# EAGLE design heart_ckt (EAGLE 8.4.1)
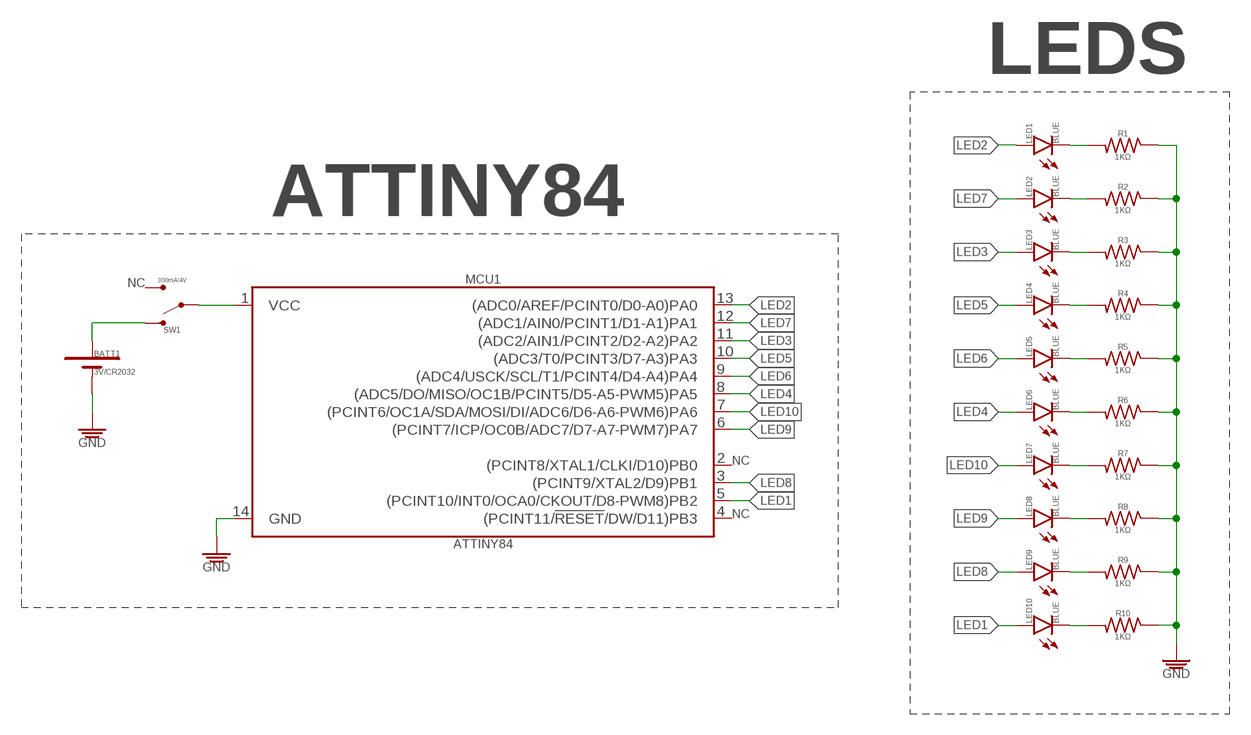
[diagram p0: schematic, sheet 1]

## Parts
BATT1  3V/CR2032  BATTERY_CELL_COINCELL-CR2032-20MM_PTH  [BATTERY_COINCELL-20MM-PTH]
LED1  BLUE  LED_SMD-0805_DISCRETE_BLUE  [LED_SMD-805_]
LED2  BLUE  LED_SMD-0805_DISCRETE_BLUE  [LED_SMD-805_]
LED3  BLUE  LED_SMD-0805_DISCRETE_BLUE  [LED_SMD-805_]
LED4  BLUE  LED_SMD-0805_DISCRETE_BLUE  [LED_SMD-805_]
LED5  BLUE  LED_SMD-0805_DISCRETE_BLUE  [LED_SMD-805_]
LED6  BLUE  LED_SMD-0805_DISCRETE_BLUE  [LED_SMD-805_]
LED7  BLUE  LED_SMD-0805_DISCRETE_BLUE  [LED_SMD-805_]
LED8  BLUE  LED_SMD-0805_DISCRETE_BLUE  [LED_SMD-805_]
LED9  BLUE  LED_SMD-0805_DISCRETE_BLUE  [LED_SMD-805_]
LED10  BLUE  LED_SMD-0805_DISCRETE_BLUE  [LED_SMD-805_]
MCU1  ATTINY84  ATTINY84_SO-14  [SO-14]
R1  1KΩ  1KΩ_SMD-0805_1/8W-5%  [RESISTOR_SMD-805]
R2  1KΩ  1KΩ_SMD-0805_1/8W-5%  [RESISTOR_SMD-805]
R3  1KΩ  1KΩ_SMD-0805_1/8W-5%  [RESISTOR_SMD-805]
R4  1KΩ  1KΩ_SMD-0805_1/8W-5%  [RESISTOR_SMD-805]
R5  1KΩ  1KΩ_SMD-0805_1/8W-5%  [RESISTOR_SMD-805]
R6  1KΩ  1KΩ_SMD-0805_1/8W-5%  [RESISTOR_SMD-805]
R7  1KΩ  1KΩ_SMD-0805_1/8W-5%  [RESISTOR_SMD-805]
R8  1KΩ  1KΩ_SMD-0805_1/8W-5%  [RESISTOR_SMD-805]
R9  1KΩ  1KΩ_SMD-0805_1/8W-5%  [RESISTOR_SMD-805]
R10  1KΩ  1KΩ_SMD-0805_1/8W-5%  [RESISTOR_SMD-805]
SW1  300mA/4V  SWITCH_SPDT_RA_SMD_300MA-4V_6.7L-2.6W  [SW_SLIDE_SPDT_RA_SMD_4V_300MA_6.7L-2.6W]

## Nets
GND: BATT1.- MCU1.14(GND) R1.1 R2.1 R3.1 R4.1 R5.1 R6.1 R7.1 R8.1 R9.1 R10.1
LED1: LED10.A MCU1.5((PCINT10/INT0/OCA0/CKOUT/D8-PWM8)PB2)
LED2: LED1.A MCU1.13((ADC0/AREF/PCINT0/D0-A0)PA0)
LED3: LED3.A MCU1.11((ADC2/AIN1/PCINT2/D2-A2)PA2)
LED4: LED6.A MCU1.8((ADC5/DO/MISO/OC1B/PCINT5/D5-A5-PWM5)PA5)
LED5: LED4.A MCU1.10((ADC3/T0/PCINT3/D7-A3)PA3)
LED6: LED5.A MCU1.9((ADC4/USCK/SCL/T1/PCINT4/D4-A4)PA4)
LED7: LED2.A MCU1.12((ADC1/AIN0/PCINT1/D1-A1)PA1)
LED8: LED9.A MCU1.3((PCINT9/XTAL2/D9)PB1)
LED9: LED8.A MCU1.6((PCINT7/ICP/OC0B/ADC7/D7-A7-PWM7)PA7)
LED10: LED7.A MCU1.7((PCINT6/OC1A/SDA/MOSI/DI/ADC6/D6-A6-PWM6)PA6)
N$1: LED1.K R1.2
N$2: LED2.K R2.2
N$3: LED3.K R3.2
N$4: LED4.K R4.2
N$5: LED5.K R5.2
N$6: LED6.K R6.2
N$7: LED7.K R7.2
N$8: LED8.K R8.2
N$9: LED10.K R10.2
N$10: LED9.K R9.2
N$11: MCU1.1(VCC) SW1.2
N$14: MCU1.4((PCINT11/!RESET!/DW/D11)PB3)
N$17: MCU1.2((PCINT8/XTAL1/CLKI/D10)PB0)
VBATT: BATT1.+ SW1.1
Unconnected: SW1.3

## Notes on the sheet
- LEDS
- ATTINY84
- NC
- NC
- NC

## Library data of the parts
BATT1 = PiB:BATTERY_CELL; CREATOR: MrSwirlyEyes; DATASHEET: https://media.digikey.com/pdf/Data%20Sheets/Panasonic%20Inustrial/CR_Series.pdf; DATASHEET_CONNECTOR: http://www.memoryprotectiondevices.com/datasheets/BS-7-datasheet.pdf; DIST: Digikey; DISTLINK: https://www.digikey.com/product-detail/en/panasonic-bsg/CR2032/P189-ND/31939; DISTLINK_CONNECTOR: https://www.digikey.com/product-detail/en/mpd-memory-protection-devices/BS-7/BS-7-ND/389447; DISTPN: P189-ND; DISTPN_CONNECTOR: BS-7-ND; DIST_CONNECTOR: Digikey; MFR: Panasonic - BSG; MFR_CONNECTOR: MPD (Memory Protection Devices); MPN: CR2032; MPN_CONNECTOR: BS-7; TESTED: NO
LED1-LED10 = PiB_leds:LED; CREATOR: MrSwirlyEyes; DATASHEET: http://optoelectronics.liteon.com/upload/download/DS-22-99-0226/LTST-C170TBKT.pdf; DIST: Digikey; DISTLINK: https://www.digikey.com/products/en?keywords=160-1579-1-ND; DISTPN: 160-1579-1-ND; MFR: Lite-On Inc.; MPN: LTST-C170TBKT; TESTED: NO
MCU1 = PiB_ic_microcontrollers:ATTINY84; CREATOR: MrSwirlyEyes; DATASHEET: http://ww1.microchip.com/downloads/en/DeviceDoc/doc8183.pdf; DIST: Digikey; DISTLINK: https://www.digikey.com/products/en?keywords=ATTINY84A-SSU-ND; DISTPN: ATTINY84A-SSU-ND; MFR: Microchip Technology; MPN: ATTINY84A-SSU; TESTED: NO
R1-R10 = PiB_resistors:1KΩ; CREATOR: Kenmei; DATASHEET: http://www.yageo.com/documents/recent/PYu-RC_Group_51_RoHS_L_7.pdf; DIST: Digikey; DISTLINK: https://www.digikey.com/product-detail/en/yageo/RC0805JR-071KL/311-1.0KARCT-ND/731165; DISTPN: 311-1.0KARCT-ND; MFR: Yageo; MPN: RC0805JR-071KL; TESTED: NO
SW1 = PiB_switches:SWITCH_SPDT; CREATOR: MrSwirlyEyes; DATASHEET: https://media.digikey.com/pdf/Data%20Sheets/APEM%20Components%20PDFs/MA_Series_.pdf; DIST: Digikey; DISTLINK: https://www.digikey.com/products/en?keywords=679-1847-1-ND; DISTPN: 679-1847-1-ND; MFR: APEM Inc.; MPN: MA12RTR; TESTED: YES

## Board
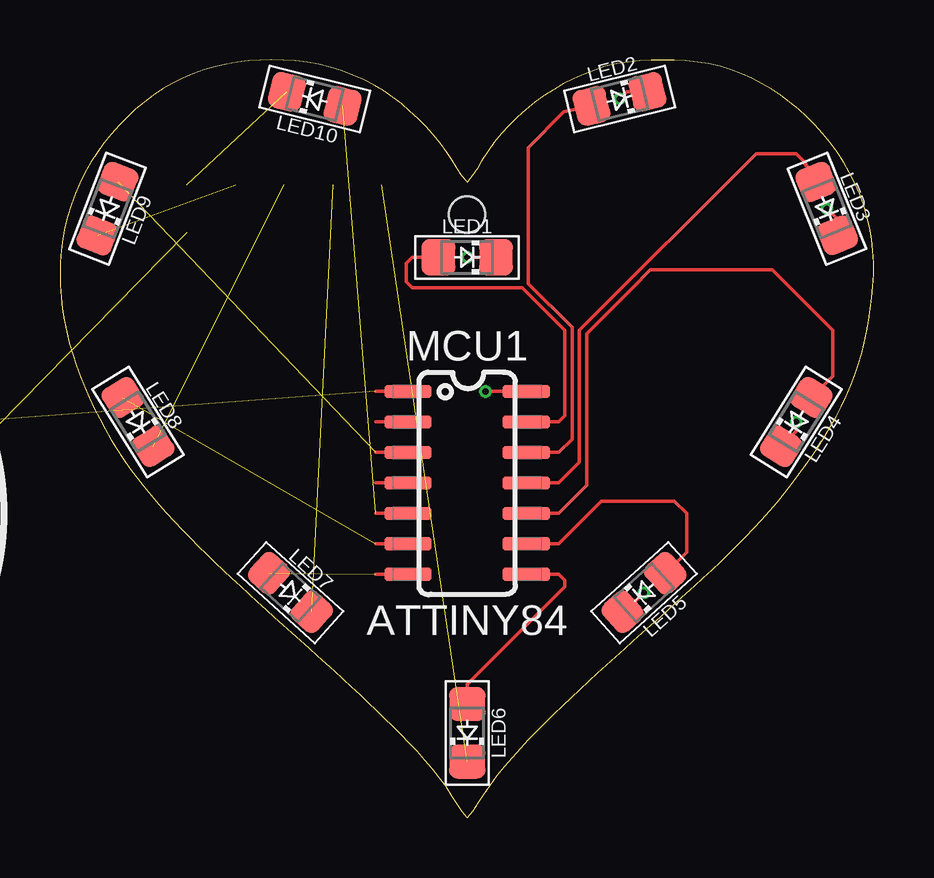
[diagram p1: board, top side]
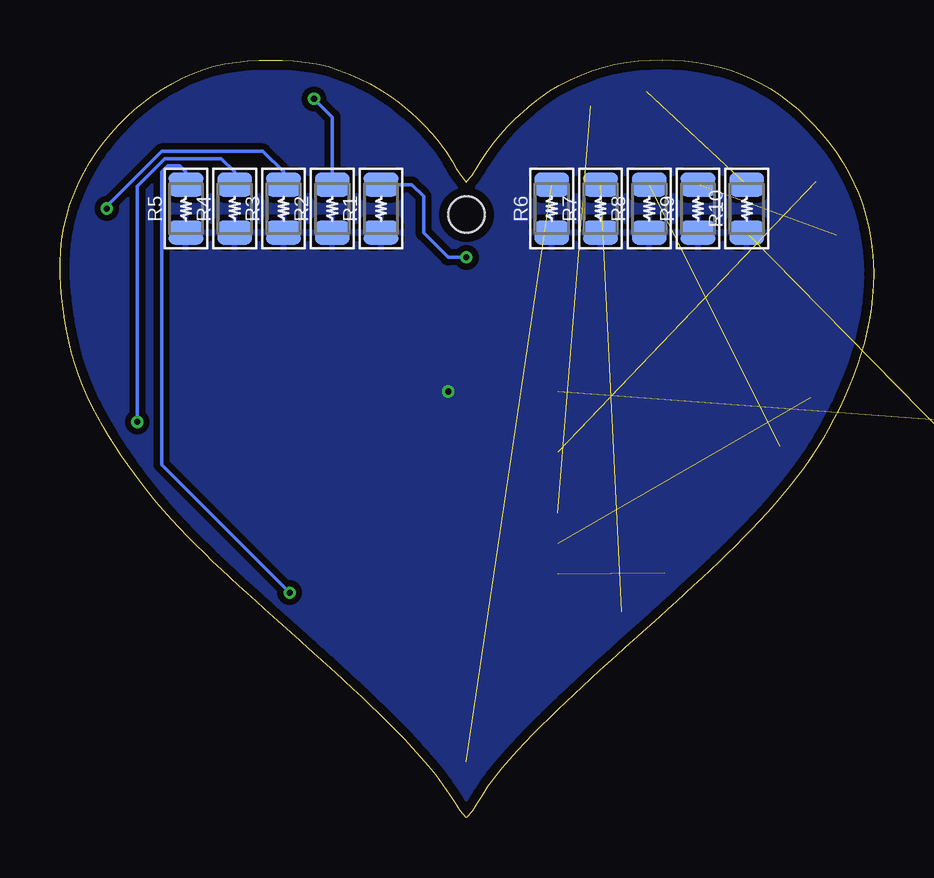
[diagram p2: board, bottom side, seen from below]

Size 33.9 x 31.58 mm. Coordinates in mm from the lower left corner, seen from the top.
Outline: 16.94,0.03 16.97,0 17.21,0.3 17.43,0.62 17.65,0.95 17.92,1.37 18.22,1.77 18.54,2.16 18.86,2.53 19.2,2.9 19.54,3.27 19.89,3.63 20.24,3.98 20.59,4.33 20.95,4.68 21.31,5.02 21.68,5.37 22.05,5.71 22.41,6.04 22.78,6.38 23.15,6.72 23.52,7.05 23.9,7.38 24.27,7.72 24.64,8.04 25,8.37 25.37,8.69 25.73,9.02 26.09,9.35 26.45,9.68 26.81,10.01 27.17,10.35 27.52,10.68 27.88,11.02 28.23,11.37 28.57,11.71 28.91,12.07 29.24,12.43 29.57,12.79 29.89,13.16 30.2,13.54 30.5,13.93 30.79,14.32 31.07,14.71 31.34,15.1 31.6,15.49 31.86,15.89 32.1,16.3 32.33,16.71 32.55,17.13 32.76,17.56 32.94,18 33.11,18.44 33.27,18.89 33.4,19.35 33.52,19.81 33.62,20.27 33.7,20.74 33.77,21.21 33.82,21.68 33.87,22.15 33.9,22.64 33.9,23.13 33.87,23.63 33.82,24.11 33.74,24.6 33.62,25.08 33.48,25.55 33.31,26.01 33.12,26.46 32.9,26.9 32.65,27.32 32.38,27.73 32.09,28.13 31.78,28.51 31.45,28.88 31.12,29.21 30.78,29.53 30.42,29.83 30.04,30.11 29.65,30.36 29.24,30.6 28.82,30.81 28.39,31 27.95,31.17 27.51,31.31 27.04,31.42 26.56,31.49 26.08,31.54 25.6,31.56 25.12,31.57 24.64,31.56 24.15,31.54 23.67,31.49 23.2,31.42 22.73,31.31 22.28,31.16 21.83,30.99 21.4,30.8 20.98,30.58 20.56,30.35 20.16,30.09 19.78,29.81 19.41,29.51 19.05,29.2 18.71,28.86 18.39,28.51 18.09,28.14 17.81,27.76 17.56,27.36 17.38,27.06 17.19,26.76 16.97,26.49 16.94,26.52
Outline: 16.94,26.52 16.94,26.52
Outline: 16.94,26.52 16.74,26.76 16.55,27.05 16.37,27.35 16.12,27.74 15.85,28.11 15.55,28.47 15.24,28.81 14.92,29.14 14.58,29.45 14.23,29.75 13.87,30.03 13.49,30.29 13.09,30.53 12.65,30.75 12.2,30.95 11.73,31.13 11.26,31.28 10.78,31.4 10.29,31.48 9.8,31.54 9.31,31.57 8.81,31.58 8.34,31.57 7.86,31.54 7.39,31.48 6.92,31.41 6.46,31.3 6,31.17 5.55,31.01 5.12,30.82 4.69,30.61 4.28,30.37 3.89,30.11 3.51,29.82 3.14,29.52 2.79,29.19 2.46,28.86 2.14,28.49 1.83,28.11 1.54,27.72 1.28,27.31 1.04,26.89 0.82,26.45 0.63,26.01 0.46,25.55 0.32,25.08 0.2,24.61 0.11,24.13 0.05,23.65 0.01,23.16 0,22.67 0.01,22.19 0.05,21.7 0.1,21.21 0.18,20.73 0.28,20.26 0.39,19.78 0.53,19.32 0.68,18.85 0.84,18.39 1.03,17.94 1.22,17.5 1.43,17.06 1.65,16.63 1.88,16.2 2.12,15.79 2.37,15.38 2.63,14.97 2.91,14.58 3.2,14.19 3.49,13.81 3.8,13.44 4.11,13.07 4.43,12.71 4.76,12.36 5.09,12.01 5.43,11.67 5.77,11.33 6.11,10.99 6.45,10.65 6.8,10.32 7.15,9.99 7.51,9.66 7.86,9.34 8.22,9.01 8.57,8.69 8.93,8.36 9.29,8.04 9.65,7.72 10.01,7.4 10.36,7.09 10.72,6.77 11.07,6.45 11.43,6.12 11.78,5.8 12.13,5.47 12.48,5.15 12.83,4.82 13.18,4.49 13.52,4.16 13.86,3.82 14.2,3.48 14.53,3.14 14.86,2.79 15.18,2.43 15.49,2.07 15.79,1.69 16.07,1.31 16.33,0.91 16.53,0.59 16.73,0.28 16.94,0.03
Outline: 16.94,0.03 16.94,0.03
Copper layers (1*16): Top 0.035559375mm / dielectric 1.6mm / Bottom 0.035559375mm
Design rules "oshpark-2layer": minimum track width 6mil, minimum drill 10mil, track to track 6mil, track to pad 6mil, pad to pad 6mil, via to via 6mil, smd to smd 6mil, copper to edge 15mil, drill to drill 6mil, minimum pad ring 5mil, minimum via ring 5mil, stop-mask expansion 2.5mil, vias tented up to drill 0mil, thermal gap 10mil
Holes 1.5 mm at 16.97,25.13

### Footprints (pad centres in the part's own frame; a part is rotated, then mirrored left to right if it is on the bottom)
BATTERY_COINCELL-20MM-PTH = drill 1.525 pad 2.725: + 0,12.535 | drill 1.195 pad 2.395: - 0,-7.465
LED_SMD-805_ = smd 1.4 x 1.5: A -1.2,0; K 1.2,0
SO-14 = smd 1.981 x 0.559: 1 -2.464,3.81; 2 -2.464,2.54; 3 -2.464,1.27; 4 -2.464,0; 5 -2.464,-1.27; 6 -2.464,-2.54; 7 -2.464,-3.81; 8 2.464,-3.81; 9 2.464,-2.54; 10 2.464,-1.27; 11 2.464,0; 12 2.464,1.27; 13 2.464,2.54; 14 2.464,3.81
RESISTOR_SMD-805 = smd 1 x 1.45: 1 -1,0; 2 1,0
SW_SLIDE_SPDT_RA_SMD_4V_300MA_6.7L-2.6W = smd 1.5 x 0.7: 1 1.75,2.25; 2 1.75,-0.75; 3 1.75,-2.25 | smd 0.6 x 1: NC1 -1,-3.65; NC3 -1,3.65 | smd 0.8 x 1: NC2 1.1,-3.65; NC4 1.1,3.65 | hole 0.9: 0,-1.5; 0,1.5

### Placement (x,y rotation side)
BATT1  -13.51,12.69 0 top  (outside the outline)
LED1  16.97,23.36 0 top
LED2  23.32,29.96 14 top
LED3  31.95,25.39 292 top
LED4  30.68,16.5 238 top
LED5  24.33,9.39 222 top
LED6  16.97,3.54 270 top
LED7  9.6,9.39 318 top
LED8  3.25,16.5 302 top
LED9  1.98,25.39 249 top
LED10  10.62,29.96 166 top
MCU1  16.97,13.96 0 top
R1  20.52,25.39 90 bottom
R2  22.55,25.39 90 bottom
R3  24.59,25.39 90 bottom
R4  26.62,25.39 90 bottom
R5  28.65,25.39 90 bottom
R6  13.41,25.39 90 bottom
R7  11.38,25.39 90 bottom
R8  9.35,25.39 90 bottom
R9  7.31,25.39 90 bottom
R10  5.28,25.39 90 bottom
SW1  -32.56,15.23 0 top  (outside the outline)

### Tracks (layer width: path | path; a pad name or v marks a point on that pad's centre or on a via)
GND  (via drill 0.25)  (1 unrouted)
  Top 0.152: MCU1.14 v17.73,17.77
  pour Bottom (isolate 0.254): -0.81,31.74 -0.81,-0.01 34.75,-0.01 34.75,31.74
LED1  (1 unrouted)
  Top 0.152: MCU1.5 13.16,12.69
LED2
  Top 0.152: MCU1.13 20.78,16.5 21.03,16.75 21.03,20.31 19.25,22.09 14.68,22.09 14.43,22.34 14.43,23.1 14.68,23.36 LED1.A
LED3
  Top 0.152: MCU1.11 20.78,13.96 21.64,14.82 21.64,20.31 29.01,27.67 30.68,27.67 30.99,27.36 LED3.A
LED4
  Top 0.152: MCU1.8 20.78,10.15 21.03,9.89 21.03,9.64 16.97,5.58 LED6.A
LED5
  Top 0.152: MCU1.10 20.78,12.69 21.94,13.86 21.94,15.74 21.94,20.18 23.84,22.07 24.6,22.84 29.68,22.84 32.21,20.31 32.21,18.4 LED4.A
LED6
  Top 0.152: MCU1.9 20.78,11.42 22.55,13.2 25.6,13.2 26.11,12.69 26.11,11.08 LED5.A
LED7
  Top 0.152: MCU1.12 20.78,15.23 21.33,15.79 21.33,20.43 19.51,22.26 19.51,27.93 20.99,29.42 LED2.A
LED8  (1 unrouted)
  Top 0.152: MCU1.3 13.16,15.23
LED9  (1 unrouted)
  Top 0.152: MCU1.6 13.16,11.42
LED10  (1 unrouted)
  Top 0.152: MCU1.7 13.16,10.15
N$1  (via drill 0.25)
  Top 0.152: LED1.K v16.97,23.36
  Bottom 0.152: v16.97,23.36 17.73,23.36 18.74,24.37 18.74,25.9 19.24,26.39 R1.2
N$2  (via drill 0.25)
  Top 0.152: LED2.K 23.61,30.25 v23.32,29.96
  Bottom 0.152: R2.2 22.55,29.2 v23.32,29.96
N$3  (via drill 0.25)
  Top 0.152: LED3.K 32.4,24.94 v31.95,25.39
  Bottom 0.152: R3.2 24.59,26.91 25.45,27.78 29.66,27.78 31.95,25.49 v31.95,25.39
N$4  (via drill 0.25)
  Top 0.152: LED4.K 30.68,16.12 v30.68,16.5
  Bottom 0.152: R4.2 26.62,26.91 27.18,27.47 29.54,27.47 30.68,26.33 v30.68,16.5
N$5  (via drill 0.25)
  Top 0.152: LED5.K 23.53,8.58 v24.33,9.39
  Bottom 0.152: R5.2 28.65,26.91 28.9,27.17 29.41,27.17 29.67,26.91 29.67,14.72 v24.33,9.39
N$6  (1 unrouted)
N$7  (1 unrouted)
N$8  (1 unrouted)
N$9  (1 unrouted)
N$10  (1 unrouted)
N$11  (1 unrouted)
  Top 0.152: MCU1.1 13.16,17.77
N$14
  Top 0.152: MCU1.4 13.16,13.96
N$17
  Top 0.152: MCU1.2 13.16,16.5
VBATT  (1 unrouted)